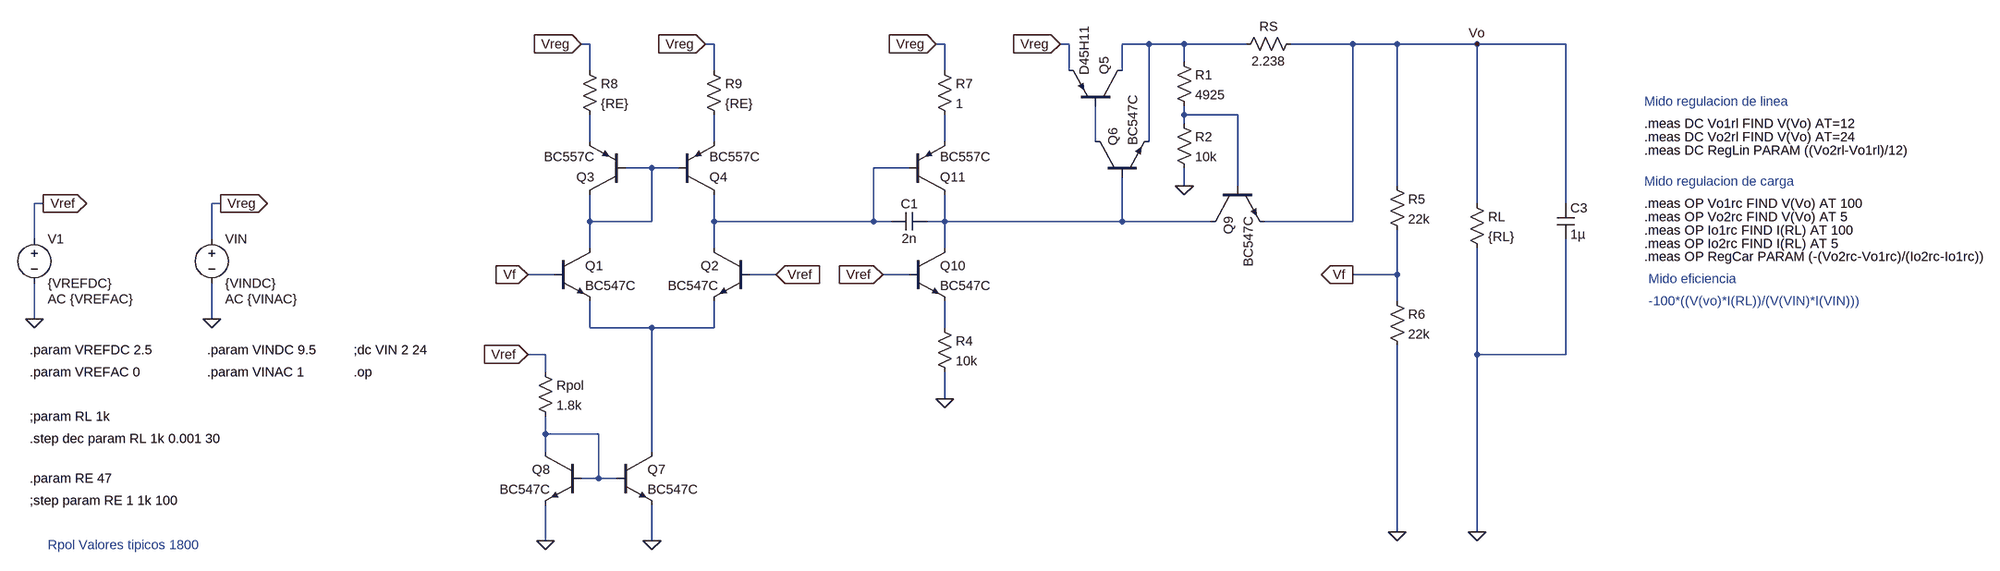
[diagram p0: schematic Version 2.5.asc]
Version 2.5.asc, the LTspice schematic file:
Version 4.1
SHEET 1 3148 1188
WIRE 96 -128 80 -128
WIRE 320 -128 304 -128
WIRE 736 -128 720 -128
WIRE 960 -128 944 -128
WIRE 1104 -128 1056 -128
WIRE 1168 -128 1104 -128
WIRE 1280 -128 1168 -128
WIRE 1472 -128 1360 -128
WIRE 1552 -128 1472 -128
WIRE 1696 -128 1552 -128
WIRE 1856 -128 1696 -128
WIRE 1168 -96 1168 -128
WIRE 96 -80 96 -128
WIRE 320 -80 320 -128
WIRE 736 -80 736 -128
WIRE 960 -80 960 -128
WIRE 1056 -80 1056 -128
WIRE 1168 0 1168 -16
WIRE 1264 0 1168 0
WIRE 1168 16 1168 0
WIRE 96 48 96 0
WIRE 320 48 320 0
WIRE 736 48 736 0
WIRE 1008 48 1008 -16
WIRE 1104 48 1104 -128
WIRE 208 96 160 96
WIRE 256 96 208 96
WIRE 672 96 608 96
WIRE 1168 128 1168 96
WIRE 1264 128 1264 0
WIRE 1552 128 1552 -128
WIRE -1008 160 -1024 160
WIRE -688 160 -704 160
WIRE 1696 160 1696 -128
WIRE 1856 160 1856 -128
WIRE 96 192 96 144
WIRE 208 192 208 96
WIRE 208 192 96 192
WIRE 320 192 320 144
WIRE 608 192 608 96
WIRE 608 192 320 192
WIRE 640 192 608 192
WIRE 736 192 736 144
WIRE 736 192 704 192
WIRE 1056 192 1056 112
WIRE 1056 192 736 192
WIRE 1216 192 1056 192
WIRE 1472 192 1472 -128
WIRE 1472 192 1312 192
WIRE -1024 224 -1024 160
WIRE -704 224 -704 160
WIRE 96 240 96 192
WIRE 320 240 320 192
WIRE 736 240 736 192
WIRE 32 288 -16 288
WIRE 432 288 384 288
WIRE 672 288 624 288
WIRE 1552 288 1552 208
WIRE 1552 288 1472 288
WIRE 1552 336 1552 288
WIRE -1024 368 -1024 304
WIRE -704 368 -704 304
WIRE 96 384 96 336
WIRE 208 384 96 384
WIRE 320 384 320 336
WIRE 320 384 208 384
WIRE 736 384 736 336
WIRE 16 432 -16 432
WIRE 1696 432 1696 240
WIRE 1856 432 1856 224
WIRE 1856 432 1696 432
WIRE 16 464 16 432
WIRE 736 512 736 464
WIRE 16 576 16 544
WIRE 112 576 16 576
WIRE 16 608 16 576
WIRE 208 608 208 384
WIRE 112 656 112 576
WIRE 112 656 80 656
WIRE 144 656 112 656
WIRE 1552 752 1552 416
WIRE 1696 752 1696 432
WIRE 16 768 16 704
WIRE 208 768 208 704
FLAG 1696 -128 Vo
FLAG -1008 160 Vref
IOPIN -1008 160 Out
FLAG 1472 288 Vf
IOPIN 1472 288 Out
FLAG -1024 368 0
FLAG -688 160 Vreg
IOPIN -688 160 Out
FLAG 1696 752 0
FLAG 1552 752 0
FLAG -16 432 Vref
IOPIN -16 432 In
FLAG -704 368 0
FLAG 16 768 0
FLAG 208 768 0
FLAG 80 -128 Vreg
IOPIN 80 -128 In
FLAG 304 -128 Vreg
IOPIN 304 -128 In
FLAG 944 -128 Vreg
IOPIN 944 -128 In
FLAG 1168 128 0
FLAG 720 -128 Vreg
IOPIN 720 -128 In
FLAG 624 288 Vref
IOPIN 624 288 In
FLAG 736 512 0
FLAG -16 288 Vf
IOPIN -16 288 In
FLAG 432 288 Vref
IOPIN 432 288 In
DATAFLAG 1856 -112 ""
DATAFLAG 368 192 ""
DATAFLAG 112 192 ""
DATAFLAG 224 96 ""
DATAFLAG 320 32 ""
DATAFLAG 736 -128 ""
DATAFLAG 768 192 ""
DATAFLAG 736 16 ""
SYMBOL pnp 160 144 R180
SYMATTR InstName Q3
SYMATTR Value BC557C
SYMBOL pnp 256 144 M180
SYMATTR InstName Q4
SYMATTR Value BC557C
SYMBOL npn 32 240 R0
SYMATTR InstName Q1
SYMATTR Value BC547C
SYMBOL npn 384 240 M0
SYMATTR InstName Q2
SYMATTR Value BC547C
SYMBOL pnp 1056 -16 M270
SYMATTR InstName Q5
SYMATTR Value D45H11
SYMBOL npn 1008 112 R270
SYMATTR InstName Q6
SYMATTR Value BC547C
SYMBOL res 1536 112 R0
SYMATTR InstName R5
SYMATTR Value 22k
SYMBOL res 1536 320 R0
SYMATTR InstName R6
SYMATTR Value 22k
SYMBOL res 1680 144 R0
SYMATTR InstName RL
SYMATTR Value {RL}
SYMBOL voltage -1024 208 R0
WINDOW 123 24 124 Left 2
WINDOW 39 0 0 Left 0
SYMATTR Value2 AC {VREFAC}
SYMATTR InstName V1
SYMATTR Value {VREFDC}
SYMBOL res 80 -96 R0
SYMATTR InstName R8
SYMATTR Value {RE}
SYMBOL res 304 -96 R0
SYMATTR InstName R9
SYMATTR Value {RE}
SYMBOL cap 1840 160 R0
SYMATTR InstName C3
SYMATTR Value 1µ
SYMBOL voltage -704 208 R0
WINDOW 123 24 124 Left 2
WINDOW 39 0 0 Left 0
SYMATTR Value2 AC {VINAC}
SYMATTR InstName VIN
SYMATTR Value {VINDC}
SYMBOL npn 144 608 R0
SYMATTR InstName Q7
SYMATTR Value BC547C
SYMBOL npn 80 608 M0
SYMATTR InstName Q8
SYMATTR Value BC547C
SYMBOL res 0 448 R0
SYMATTR InstName Rpol
SYMATTR Value 1.8k
SYMBOL npn 1216 128 M90
SYMATTR InstName Q9
SYMATTR Value BC547C
SYMBOL res 1376 -144 R90
WINDOW 0 0 56 VBottom 2
WINDOW 3 32 56 VTop 2
SYMATTR InstName RS
SYMATTR Value 2.238
SYMBOL res 1152 0 R0
SYMATTR InstName R2
SYMATTR Value 10k
SYMBOL res 1152 -112 R0
SYMATTR InstName R1
SYMATTR Value 4925
SYMBOL cap 704 176 R90
WINDOW 0 0 32 VBottom 2
WINDOW 3 32 32 VTop 2
SYMATTR InstName C1
SYMATTR Value 2n
SYMBOL npn 672 240 R0
SYMATTR InstName Q10
SYMATTR Value BC547C
SYMBOL res 720 368 R0
SYMATTR InstName R4
SYMATTR Value 10k
SYMBOL res 720 -96 R0
SYMATTR InstName R7
SYMATTR Value 1
SYMBOL pnp 672 144 M180
SYMATTR InstName Q11
SYMATTR Value BC557C
TEXT -448 464 Left 2 !.op
TEXT -712 424 Left 2 !.param VINDC 9.5
TEXT -712 464 Left 2 !.param VINAC 1
TEXT -1032 424 Left 2 !.param VREFDC 2.5
TEXT -1032 464 Left 2 !.param VREFAC 0
TEXT -1032 544 Left 2 !;param RL 1k
TEXT -448 424 Left 2 !;dc VIN 2 24
TEXT -1032 696 Left 2 !;step param RE 1 1k 100
TEXT -1032 656 Left 2 !.param RE 47
TEXT -1032 584 Left 2 !.step dec param RL 1k 0.001 30
TEXT 2064 -24 Left 2 ;Mido regulacion de linea
TEXT 2064 16 Left 2 !.meas DC Vo1rl FIND V(Vo) AT=12
TEXT 2064 40 Left 2 !.meas DC Vo2rl FIND V(Vo) AT=24
TEXT 2064 64 Left 2 !.meas DC RegLin PARAM ((Vo2rl-Vo1rl)/12)
TEXT 2064 120 Left 2 ;Mido regulacion de carga
TEXT 2064 160 Left 2 !.meas OP Vo1rc FIND V(Vo) AT 100
TEXT 2064 184 Left 2 !.meas OP Vo2rc FIND V(Vo) AT 5
TEXT 2064 208 Left 2 !.meas OP Io1rc FIND I(RL) AT 100
TEXT 2064 232 Left 2 !.meas OP Io2rc FIND I(RL) AT 5
TEXT 2072 296 Left 2 ;Mido eficiencia
TEXT 2072 336 Left 2 ;-100*((V(vo)*I(RL))/(V(VIN)*I(VIN)))
TEXT 2064 256 Left 2 !.meas OP RegCar PARAM (-(Vo2rc-Vo1rc)/(Io2rc-Io1rc))
TEXT -1000 776 Left 2 ;Rpol Valores tipicos 1800

The netlist it stands for:
* Version 2.5.asc
Q3 N007 N007 N003 0 BC557C
Q4 N008 N007 N004 0 BC557C
Q1 N007 Vf N010 0 BC547C
Q2 N008 Vref N010 0 BC547C
Q5 N001 N006 Vreg 0 D45H11
Q6 N006 N009 N001 0 BC547C
R5 Vo Vf 22k
R6 Vf 0 22k
RL Vo 0 {RL}
V1 Vref 0 {VREFDC} AC {VREFAC}
R8 Vreg N003 {RE}
R9 Vreg N004 {RE}
C3 Vo 0 1µ
VIN Vreg 0 {VINDC} AC {VINAC}
Q7 N010 N012 0 0 BC547C
Q8 N012 N012 0 0 BC547C
Rpol Vref N012 1.8k
Q9 N009 N002 Vo 0 BC547C
RS Vo N001 2.238
R2 N002 0 10k
R1 N001 N002 4925
C1 N009 N008 2n
Q10 N009 Vref N011 0 BC547C
R4 N011 0 10k
R7 Vreg N005 1
Q11 N009 N008 N005 0 BC557C
.model NPN NPN
.model PNP PNP
.lib standard.bjt
.op
.param VINDC 9.5
.param VINAC 1
.param VREFDC 2.5
.param VREFAC 0
;param RL 1k
;dc VIN 2 24
;step param RE 1 1k 100
.param RE 47
.step dec param RL 1k 0.001 30
* Mido regulacion de linea
.meas DC Vo1rl FIND V(Vo) AT=12
.meas DC Vo2rl FIND V(Vo) AT=24
.meas DC RegLin PARAM ((Vo2rl-Vo1rl)/12)
* Mido regulacion de carga
.meas OP Vo1rc FIND V(Vo) AT 100
.meas OP Vo2rc FIND V(Vo) AT 5
.meas OP Io1rc FIND I(RL) AT 100
.meas OP Io2rc FIND I(RL) AT 5
* Mido eficiencia
* -100*((V(vo)*I(RL))/(V(VIN)*I(VIN)))
.meas OP RegCar PARAM (-(Vo2rc-Vo1rc)/(Io2rc-Io1rc))
* Rpol Valores tipicos 1800
.backanno
.end

* Results of the author's LTspice run, read from the files saved beside the schematic
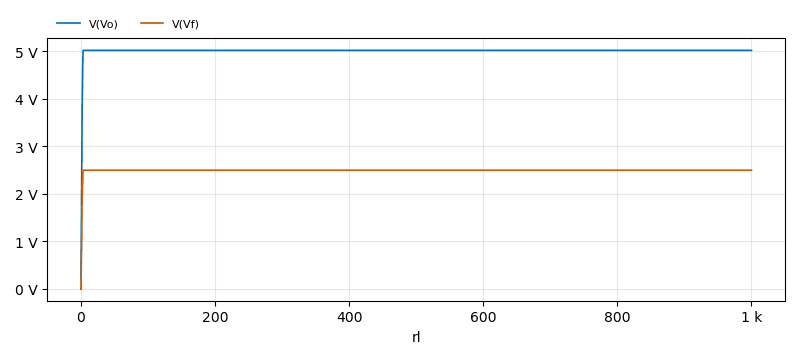
[diagram p1: Operating Point of Version 2.5.asc, plotted from the saved traces]
* Operating Point, 1 run:
*   V(Vo): 2.342 mV at rl=1 m, 5.023 V at rl=1 k, min 2.342 mV, max 5.023 V
*   V(Vf): 1.171 mV at rl=1 m, 2.5 V at rl=1 k, min 1.171 mV, max 2.5 V
* From the log:
*   vo1rc: V(Vo)=5.02332019806 at 100
*   vo2rc: V(Vo)=5.02329244977 at 5
*   io1rc: I(RL)=0.0502332039177 at 100
*   io2rc: I(RL)=1.00484231045 at 5
*   regcar: (-(Vo2rc-Vo1rc)/(Io2rc-Io1rc))=2.90676963717e-05